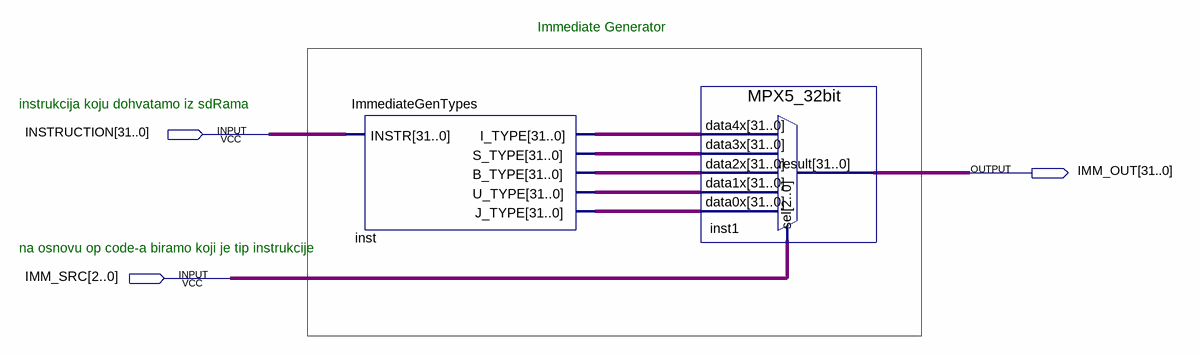
[diagram p0: schematic sheet]
// Quartus schematic ImmediateGenerator.bdf as structural Verilog: 2 symbols, 3 pins
module ImmediateGenerator (
  input  [31:0] INSTRUCTION,
  input  [2:0] IMM_SRC,
  output [31:0] IMM_OUT
);

  wire [31:0] inst_b_type, inst_i_type, inst_j_type, inst_s_type, inst_u_type;

  ImmediateGenTypes inst (
    .INSTR(INSTRUCTION), .I_TYPE(inst_i_type), .S_TYPE(inst_s_type), .B_TYPE(inst_b_type),
    .U_TYPE(inst_u_type), .J_TYPE(inst_j_type));
  MPX5_32bit inst1 (
    .data4x(inst_i_type), .data3x(inst_s_type), .data2x(inst_b_type), .data1x(inst_u_type),
    .data0x(inst_j_type), .sel(IMM_SRC), .result(IMM_OUT));

  // Notes on the sheet:
  //   Immediate Generator
  //   instrukcija koju dohvatamo iz sdRama
  //   na osnovu op code-a biramo koji je tip instrukcije
endmodule
